# Altium schematic sheet Filter_Load.SchDoc
size A; SheetNumber: 4; SheetTotal: 6
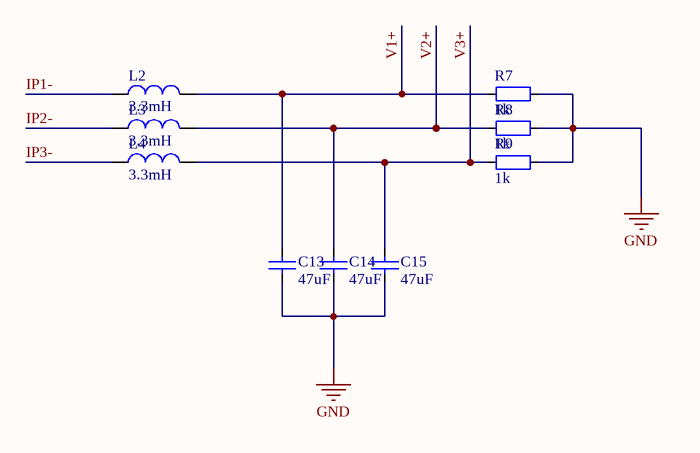
[diagram p0: Filter_Load.SchDoc]

## Parts
C13  47uF  [CAP_0402]
C14  47uF  [CAP_0402]
C15  47uF  [CAP_0402]
L2  3.3mH  [Inductor]
L3  3.3mH  [Inductor]
L4  3.3mH  [Inductor]
R7  1k  [RES-SMD-0101]
R8  1k  [RES-SMD-0101]
R9  1k  [RES-SMD-0101]

## Nets
GND: C13.1 C14.1 C15.1 R7.2 R8.2 R9.2
IP1-: L2.1
IP2-: L3.1
IP3-: L4.1
V1+: C13.2 L2.2 R7.1
V2+: C14.2 L3.2 R8.1
V3+: C15.2 L4.2 R9.1

## Library data of the parts
C13-C15 = CapSMD: Capacitor; Value: 33p; Published: 8-Jun-2000; LatestRevisionDate: 17-Jul-2002; LatestRevisionNote: Re-released for DXP Platform.; PackageReference: RAD-0.3; Publisher: Altium Limited
L2-L4 = Inductor: Value: 150 mH
R7-R9 = Resistor - SMD: Resistor; Manufacturer: Generic Components; Class: Passive; Published: 08/06/2000; Publisher: Altium Hobart Technology Centre